# Altium schematic sheet RegisterMemAddr.SchDoc: Memory Address Register
size A4; Author: Ben Eater; DrawnBy: LittleYe233; SheetNumber: 6; SheetTotal: 6
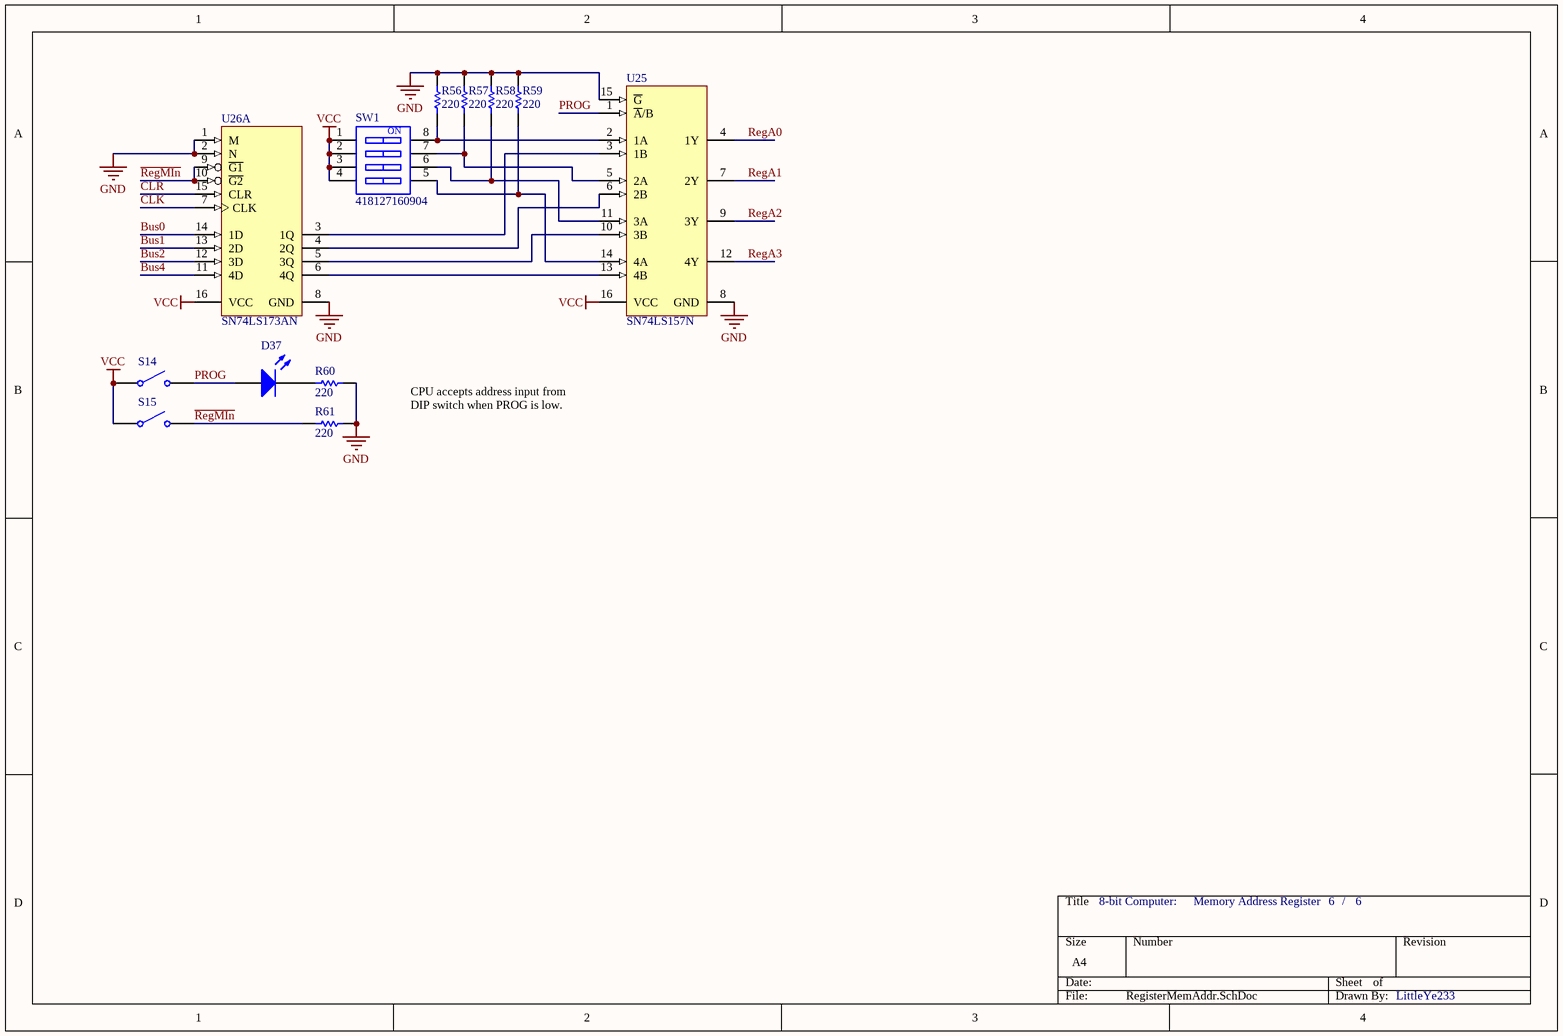
[diagram p0: RegisterMemAddr.SchDoc]

## Parts
D37  Light-Emitting Diode  (value not drawn)
R56  value 220  (hidden comment: Resistor)
R57  value 220  (hidden comment: Resistor)
R58  value 220  (hidden comment: Resistor)
R59  value 220  (hidden comment: Resistor)
R60  value 220  (hidden comment: Resistor)
R61  value 220  (hidden comment: Resistor)
S14  Single-Pole, Single-Throw Switch  (value not drawn)
S15  Single-Pole, Single-Throw Switch  (value not drawn)
SW1  418127160904  [418127160904]
U25  SN74LS157N  [N0016A]
U26  SN74LS173AN  [N0016A]  (part A of 2)

## Nets
GND: R56.2 R57.2 R58.2 R59.2 R60.1 R61.1 U25.8(GND) U25.15(~{G}) U26.1(M) U26.2(N) U26.8(GND)
VCC: S14.1 S15.1 SW1.1 SW1.2 SW1.3 SW1.4 U25.16(VCC) U26.16(VCC)
Bus0: U26.14(1D)
Bus1: U26.13(2D)
Bus2: U26.12(3D)
Bus4: U26.11(4D)
CLK: U26.7(CLK)
CLR: U26.15(CLR)
PROG: D37.1(A) S14.2 U25.1(~{A}/B)
~{RegMIn}: R61.2 S15.2 U26.9(~{G1}) U26.10(~{G2})
RegA0: U25.4(1Y)
RegA1: U25.7(2Y)
RegA2: U25.9(3Y)
RegA3: U25.12(4Y)
NetD37_2: D37.2(K) R60.2
NetR56_1: R56.1 SW1.8 U25.2(1A)
NetR57_1: R57.1 SW1.7 U25.5(2A)
NetR58_1: R58.1 SW1.6 U25.11(3A)
NetR59_1: R59.1 SW1.5 U25.14(4A)
NetU25_3: U25.3(1B) U26.3(1Q)
NetU25_6: U25.6(2B) U26.4(2Q)
NetU25_10: U25.10(3B) U26.5(3Q)
NetU25_13: U25.13(4B) U26.6(4Q)

## Notes on the sheet
- CPU accepts address input from DIP switch when PROG is low.
- 8-bit Computer:
- /
- (in symbol CMP-1439-00004-2) ON

## Library data of the parts
D37 = LED: AF: 1; BV: 0; BV_MAX: 1e99; EG: 1.11; FC: 0.5; IBV: 0.001; IS: 1e-14; MJSW: 0.33; NTUN: 30; TNOM: 27; XTI: 3; SimulationGenericComponent: True; CJO: 0; CJP: 0; CTA: 0; CTP: 0; FCS: 0.5; FV_MAX: 1e99; IKF: 0; IKR: 0; ISR: 1e-14; JSW: 0; JTUN: 0; JTUNSW: 0; KEG: 1; KF: 0; LEVEL: 1; N: 1; NBV: 1; NR: 1; NS: 1; PHP: 1; RS: 0; TCV: 0; TLEV: 0; TLEVC: 0; TM1: 0; TM2: 0; TPB: 0; TPHP: 0; TRS: 0; TRS2: 0; TT: 0; TTT1: 0; TTT2: 0; VJ: 1; XTITUN: 3
R56-R61 = Resistor: TC1: 0; SimulationGenericComponent: True; TC2: 0
S14 S15 = SPST SW: closed: 0; Rclosed: 1m; Ropen: 1Meg; SimulationGenericComponent: True
SW1 = CMP-1439-00004-2: NexarPartId: 57114393; Voltage Rating (DC): 24V; Throw Configuration: SPST; Number of Positions: 4; Pitch: 2.54mm; Current Rating: 25mA; Insulation Resistance: 100MΩ; Mechanical Life: 5kcycles; Body Material: Polyphenylene; Electrical Life: 2kcycles; Washable: Yes; Termination: PC Pin; Contact Plating: Gold; Length: 11.1mm; Min Operating Temperature: -40°C; Mount: Through Hole; Voltage Rating: 24V; Max Operating Temperature: 85°C; RoHS: Compliant
U25 = CMP-1633-00683-2: Quadruple 2-Line To 1-Line Data Selectors/Multiplexers, N0016A, TUBE; Manufacturer: Texas Instruments; Configuration: 2：1; Voltage(Nom)(V): 5; ICC @ Nom Voltage(Max)(mA): 16; VCC(Min)(V): 4.75; Channels(#): 4; Rating: Military; tpd @ Nom Voltage(Max)(ns): 14; F @ Nom Voltage(Max)(Mhz): 35; Technology Family: LS; Output Drive (IOL/IOH)(Max)(mA): 8/-0.4; Function: Encoder/Multiplexer; Schmitt Trigger: No; VCC(Max)(V): 5.25; Generic Part Number: SN74LS157; DatasheetVersion: SDLS058; Code_JEDEC: MS-001; Operating Temperature Range(C): 0 to 70; Type: Standard; PackageReference: N0016A
U26 = CMP-1619-00777-2: 4-Bit D-type Registers with 3-State Outputs, N0016A, TUBE; Manufacturer: Texas Instruments; VCC(Max)(V): 5.25; ICC @ Nom Voltage(Max)(mA): 24; F @ Nom Voltage(Max)(Mhz): 35; Bits(#): 4; tpd @ Nom Voltage(Max)(ns): 30; Output Logic: Non-inverted; VCC(Min)(V): 4.75; 3-State Output: Yes; Voltage(Nom)(V): 5; Output Drive (IOL/IOH)(Max)(mA): 24/-2.6; Rating: Catalog; Output: 3S; Input Type: TTL; Technology Family: LS; Schmitt Trigger: No; Operating Temperature Range(C): 0 to 70; DatasheetVersion: SDLS067A; Generic Part Number: SN74LS173A; Output Type: TTL; PackageReference: N0016A; Code_JEDEC: MS-001